# EAGLE design B212C (EAGLE 6.6.0)
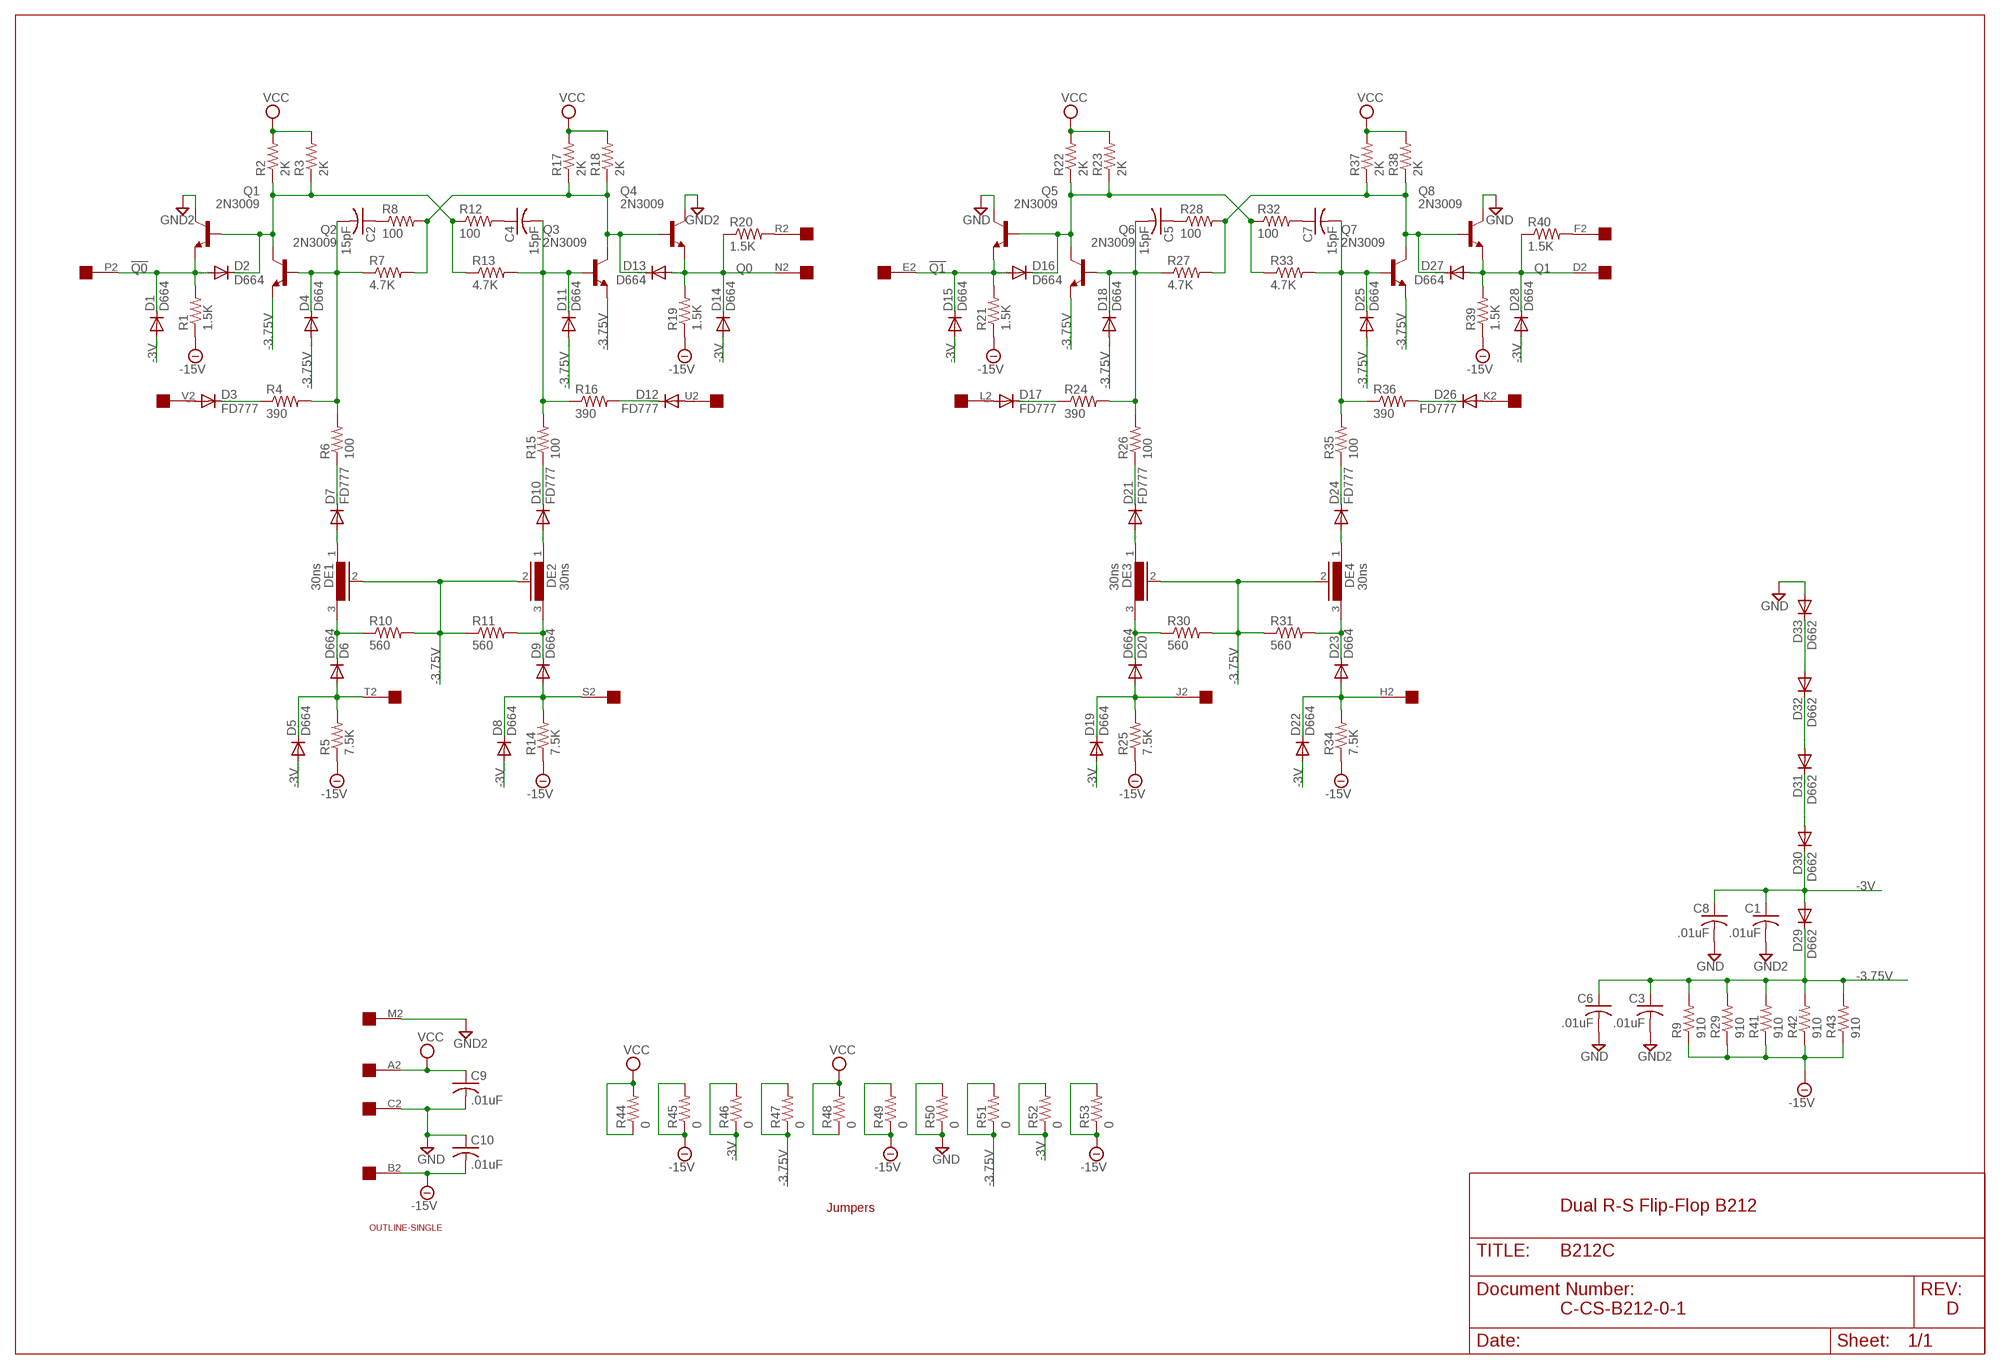
[diagram p0: schematic, sheet 1]

## Parts
C1  .01uF  C-US  [C063-025X075]
C2  15pF  C-US  [C063-025X075]
C3  .01uF  C-US  [C063-025X075]
C4  15pF  C-US050-025X075  [C050-025X075]
C5  15pF  C-US  [C063-025X075]
C6  .01uF  C-US  [C063-025X075]
C7  15pF  C-US  [C063-025X075]
C8  .01uF  C-US  [C063-025X075]
C9  .01uF  C-US  [C063-025X075]
C10  .01uF  C-US  [C063-025X075]
D1  D664  DIODE-DO35-10  [DO35-10]
D2  D664  DIODE-DO35-10  [DO35-10]
D3  FD777  DIODE-DO35-10  [DO35-10]
D4  D664  DIODE-DO35-10  [DO35-10]
D5  D664  DIODE-DO35-10  [DO35-10]
D6  D664  DIODE-DO35-10  [DO35-10]
D7  FD777  DIODE-DO35-10  [DO35-10]
D8  D664  DIODE-DO35-10  [DO35-10]
D9  D664  DIODE-DO35-10  [DO35-10]
D10  FD777  DIODE-DO35-10  [DO35-10]
D11  D664  DIODE-DO35-10  [DO35-10]
D12  FD777  DIODE-DO35-10  [DO35-10]
D13  D664  DIODE-DO35-10  [DO35-10]
D14  D664  DIODE-DO35-10  [DO35-10]
D15  D664  DIODE-DO35-10  [DO35-10]
D16  D664  DIODE-DO35-10  [DO35-10]
D17  FD777  DIODE-DO35-10  [DO35-10]
D18  D664  DIODE-DO35-10  [DO35-10]
D19  D664  DIODE-DO35-10  [DO35-10]
D20  D664  DIODE-DO35-10  [DO35-10]
D21  FD777  DIODE-DO35-10  [DO35-10]
D22  D664  DIODE-DO35-10  [DO35-10]
D23  D664  DIODE-DO35-10  [DO35-10]
D24  FD777  DIODE-DO35-10  [DO35-10]
D25  D664  DIODE-DO35-10  [DO35-10]
D26  FD777  DIODE-DO35-10  [DO35-10]
D27  D664  DIODE-DO35-10  [DO35-10]
D28  D664  DIODE-DO35-10  [DO35-10]
D29  D662  DIODE-DO35-10  [DO35-10]
D30  D662  DIODE-DO35-10  [DO35-10]
D31  D662  DIODE-DO35-10  [DO35-10]
D32  D662  DIODE-DO35-10  [DO35-10]
D33  D662  DIODE-DO35-10  [DO35-10]
DE1  30ns  RCL-L-00-05  [RCL-L-00-05]
DE2  30ns  RCL-L-00-05  [RCL-L-00-05]
DE3  30ns  RCL-L-00-05  [RCL-L-00-05]
DE4  30ns  RCL-L-00-05  [RCL-L-00-05]
Q1  2N3009  -NPN-TO5  [TO5]
Q2  2N3009  -NPN-TO5  [TO5]
Q3  2N3009  -NPN-TO5  [TO5]
Q4  2N3009  -NPN-TO5  [TO5]
Q5  2N3009  -NPN-TO5  [TO5]
Q6  2N3009  -NPN-TO5  [TO5]
Q7  2N3009  -NPN-TO5  [TO5]
Q8  2N3009  -NPN-TO5  [TO5]
R1  1.5K  R-US_0207/10  [0207/10]
R2  2K  R-US_0207/10  [0207/10]
R3  2K  R-US_0207/10  [0207/10]
R4  390  R-US_0207/10  [0207/10]
R5  7.5K  R-US_0207/10  [0207/10]
R6  100  R-US_0207/10  [0207/10]
R7  4.7K  R-US_0207/10  [0207/10]
R8  100  R-US_0207/10  [0207/10]
R9  910  R-US_0207/10  [0207/10]
R10  560  R-US_0207/10  [0207/10]
R11  560  R-US_0207/10  [0207/10]
R12  100  R-US_0207/10  [0207/10]
R13  4.7K  R-US_0207/10  [0207/10]
R14  7.5K  R-US_0207/10  [0207/10]
R15  100  R-US_0207/10  [0207/10]
R16  390  R-US_0207/10  [0207/10]
R17  2K  R-US_0207/10  [0207/10]
R18  2K  R-US_0207/10  [0207/10]
R19  1.5K  R-US_0207/10  [0207/10]
R20  1.5K  R-US_0207/10  [0207/10]
R21  1.5K  R-US_0207/10  [0207/10]
R22  2K  R-US_0207/10  [0207/10]
R23  2K  R-US_0207/10  [0207/10]
R24  390  R-US_0207/10  [0207/10]
R25  7.5K  R-US_0207/10  [0207/10]
R26  100  R-US_0207/10  [0207/10]
R27  4.7K  R-US_0207/10  [0207/10]
R28  100  R-US_0207/10  [0207/10]
R29  910  R-US_0207/10  [0207/10]
R30  560  R-US_0207/10  [0207/10]
R31  560  R-US_0207/10  [0207/10]
R32  100  R-US_0207/10  [0207/10]
R33  4.7K  R-US_0207/10  [0207/10]
R34  7.5K  R-US_0207/10  [0207/10]
R35  100  R-US_0207/10  [0207/10]
R36  390  R-US_0207/10  [0207/10]
R37  2K  R-US_0207/10  [0207/10]
R38  2K  R-US_0207/10  [0207/10]
R39  1.5K  R-US_0207/10  [0207/10]
R40  1.5K  R-US_0207/10  [0207/10]
R41  910  R-US_0207/10  [0207/10]
R42  910  R-US_0207/10  [0207/10]
R43  910  R-US_0207/10  [0207/10]
R44  0  R-US_0207/10  [0207/10]
R45  0  R-US_0207/10  [0207/10]
R46  0  R-US_0207/10  [0207/10]
R47  0  R-US_0207/10  [0207/10]
R48  0  R-US_0207/10  [0207/10]
R49  0  R-US_0207/10  [0207/10]
R50  0  R-US_0207/10  [0207/10]
R51  0  R-US_0207/10  [0207/10]
R52  0  R-US_0207/10  [0207/10]
R53  0  R-US_0207/10  [0207/10]
U$1  OUTLINE-SINGLE  [SINGLE]
U$2  EDGE-1  [EDGE-CON1]

## Nets
!Q0: D1.C D2.A Q1.1(E) R1.2 U$2.P2
!Q1: D15.C D16.A Q5.1(E) R21.2 U$2.E2
-3.75V: C3.1 C6.1 D4.A D11.A D18.A D25.A D29.C DE1.2 DE2.2 DE3.2 DE4.2 Q2.1(E) Q3.1(E) Q6.1(E) Q7.1(E) R9.2 R10.2 R11.1 R29.2 R30.2 R31.1 R41.2 R42.2 R43.2 R47.1 R47.2 R51.1 R51.2
-3V: C1.1 C8.1 D1.A D5.A D8.A D14.A D15.A D19.A D22.A D28.A D29.A D30.C R46.1 R46.2 R52.1 R52.2
-15V: C10.2 R1.1 R5.1 R9.1 R14.1 R19.1 R21.1 R25.1 R29.1 R34.1 R39.1 R41.1 R42.1 R43.1 R45.1 R45.2 R49.1 R49.2 R53.1 R53.2 U$2.B2
GND: C6.2 C8.2 C9.2 C10.1 D33.A Q5.3(C) Q8.3(C) R50.1 R50.2 U$2.C2
GND2: C1.2 C3.2 Q1.3(C) Q4.3(C) U$2.M2
N$1: C2.1 R8.1
N$2: C2.2 D4.C Q2.2(B) R4.2 R6.2 R7.1
N$3: D13.C Q3.3(C) Q4.2(B) R7.2 R8.2 R17.1 R18.1
N$4: D2.C Q1.2(B) Q2.3(C) R2.1 R3.1 R12.1 R13.1
N$5: D3.C R4.1
N$6: D30.A D31.C
N$7: D31.A D32.C
N$8: D32.A D33.C
N$9: D3.A U$2.V2
N$10: D7.C R6.1
N$11: D7.A DE1.1
N$12: D9.C DE2.3 R11.2
N$13: D6.C DE1.3 R10.1
N$14: D5.C D6.A R5.2 U$2.T2
N$15: C4.1 R12.2
N$16: C4.2 D11.C Q3.2(B) R13.2 R15.2 R16.1
N$17: D10.A DE2.1
N$18: D10.C R15.1
N$19: D12.A U$2.U2
N$20: D12.C R16.2
N$21: R20.2 U$2.R2
N$22: D8.C D9.A R14.2 U$2.S2
N$23: D16.C Q5.2(B) Q6.3(C) R22.1 R23.1 R32.1 R33.1
N$24: D26.C R36.2
N$25: C5.2 D18.C Q6.2(B) R24.2 R26.2 R27.1
N$26: D17.A U$2.L2
N$27: D17.C R24.1
N$28: D21.A DE3.1
N$29: D21.C R26.1
N$30: D19.C D20.A R25.2 U$2.J2
N$31: C5.1 R28.1
N$32: D27.C Q7.3(C) Q8.2(B) R27.2 R28.2 R37.1 R38.1
N$33: C7.1 R32.2
N$34: C7.2 D25.C Q7.2(B) R33.2 R35.2 R36.1
N$35: R40.2 U$2.F2
N$36: D26.A U$2.K2
N$37: D24.A DE4.1
N$38: D24.C R35.1
N$39: D20.C DE3.3 R30.1
N$40: D23.C DE4.3 R31.2
N$41: D22.C D23.A R34.2 U$2.H2
Q0: D13.A D14.C Q4.1(E) R19.2 R20.1 U$2.N2
Q1: D27.A D28.C Q8.1(E) R39.2 R40.1 U$2.D2
VCC: C9.1 R2.2 R3.2 R17.2 R18.2 R22.2 R23.2 R37.2 R38.2 R44.1 R44.2 R48.1 R48.2 U$2.A2

## Notes on the sheet
- Jumpers | Dual R-S Flip-Flop B212
- C-CS-B212-0-1 | D

## Library data of the parts
C1-C3 C5-C10 = dec-con:C-US: Capacitors with funky DEC lead spacing.
C4 = rcl:C-US: CAPACITOR, American symbol
D1-D33 = diode:DIODE-: DIODE
DE1-DE4 = dec-con:RCL-L-00-05: RCL-L Delay Line
Q1-Q8 = transistor:*-NPN-: NPN Transistror BF959 corrected 2008.03.06
R1-R53 = rcl:R-US_: RESISTOR, American symbol
U$1 = dec-con:OUTLINE-*: Board outlines for DEC boards.
U$2 = dec-con:EDGE-1: Single-Sided DEC Edge Connector -- (side 2)

## Board
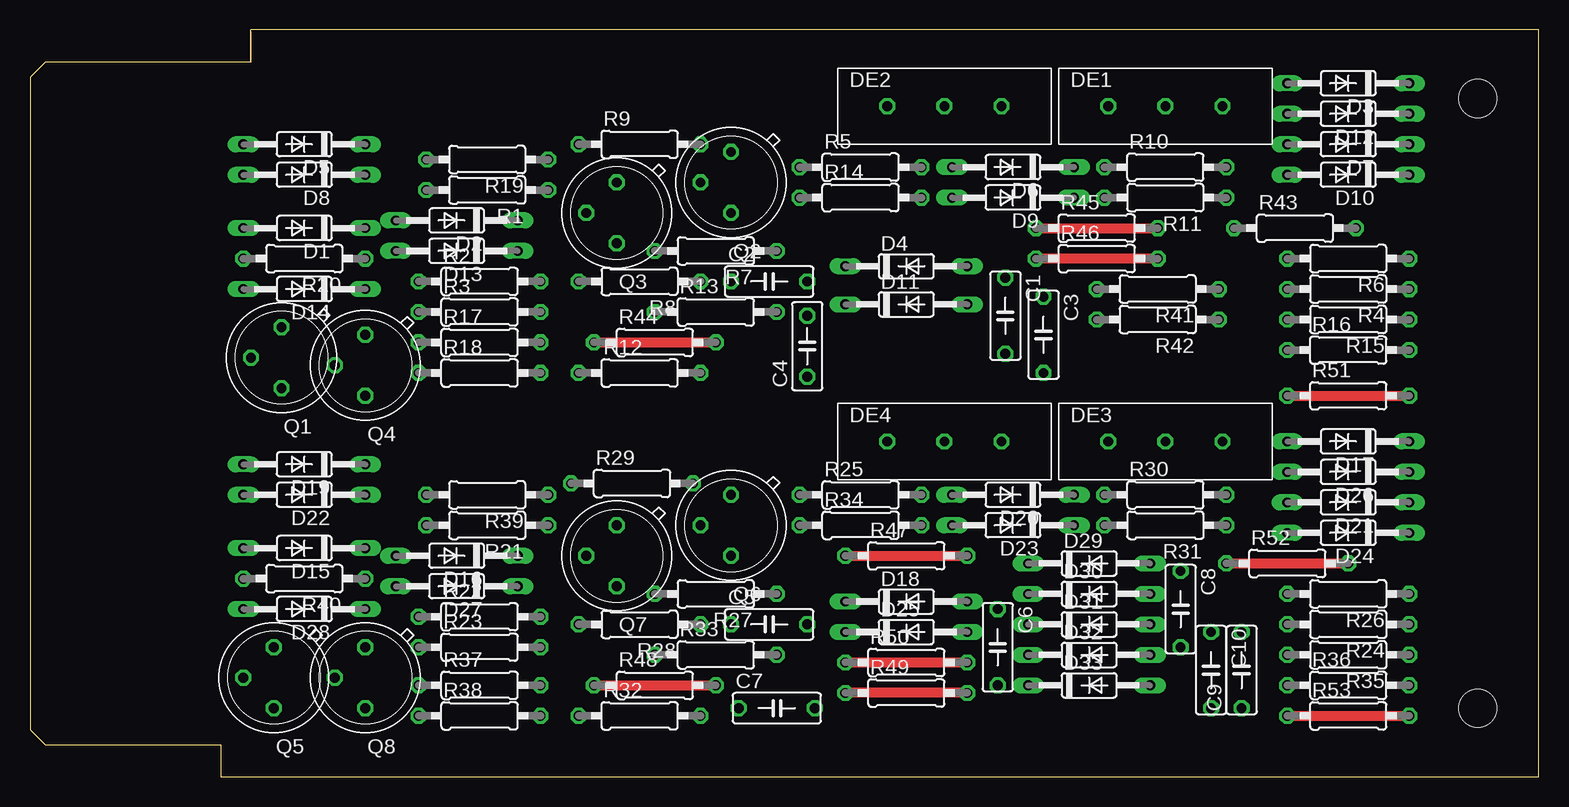
[diagram p1: board, top side]
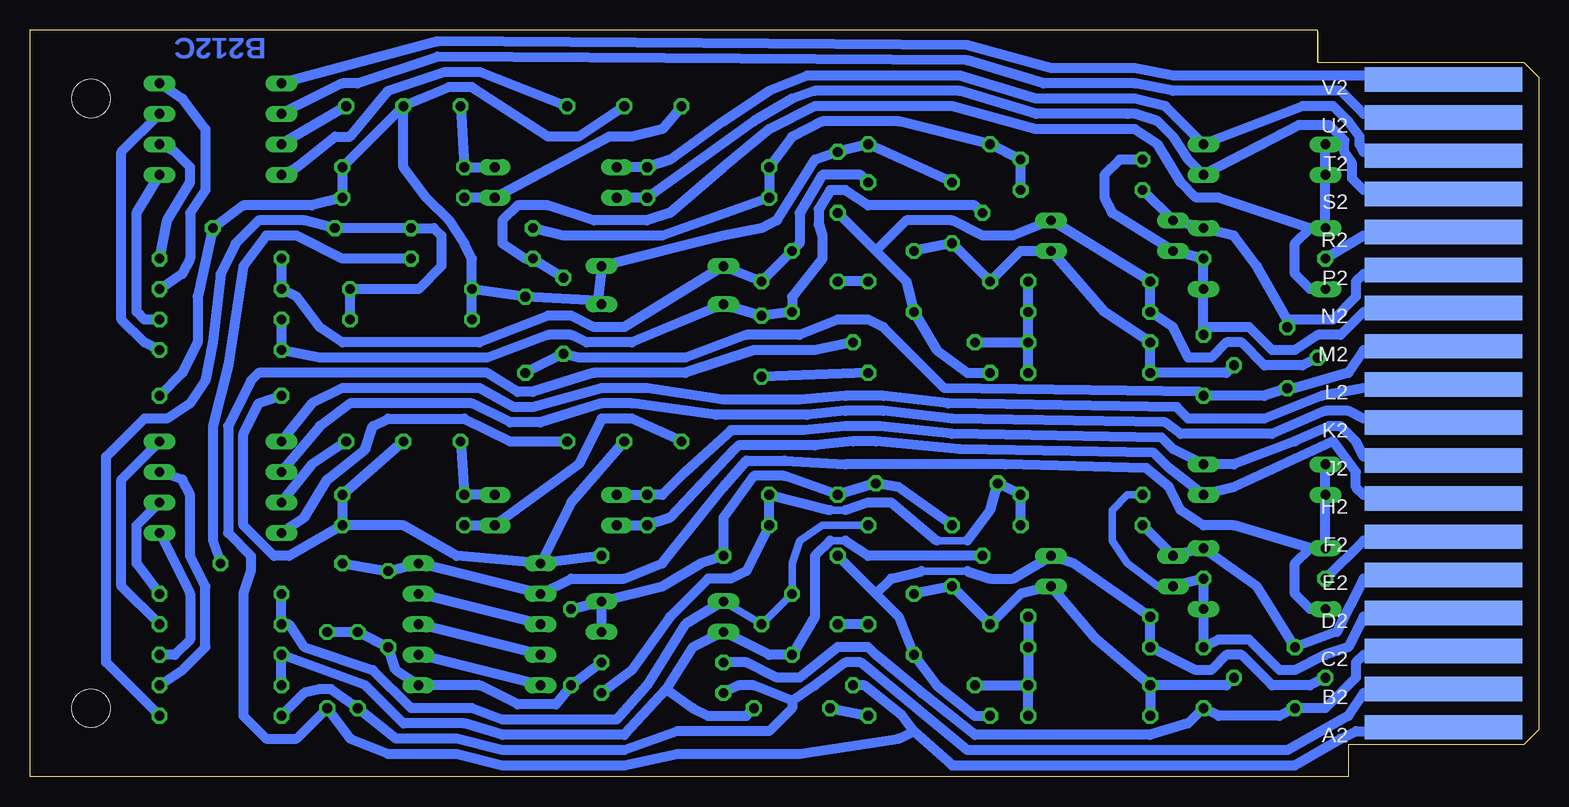
[diagram p2: board, bottom side, seen from below]

Size 125.73 x 62.23 mm. Coordinates in mm from the lower left corner, seen from the top.
Copper layers (1+16): Top 0.035mm / dielectric 1.5mm / Bottom 0.035mm
Design rules "16mils": minimum track width 16mil, minimum drill 32mil, track to track 15mil, track to pad 10mil, pad to pad 10mil, via to via 10mil, smd to smd 10mil, copper to edge 13mil, drill to drill 10mil, minimum pad ring 10mil, minimum via ring 8mil, stop-mask expansion 0mil, vias tented up to drill 0mil, thermal gap 10mil

### Footprints (pad centres in the part's own frame; a part is rotated, then mirrored left to right if it is on the bottom)
C063-025X075 = drill 0.813 octagon: 1 -2.54,0; 2 3.81,0
C050-025X075 = drill 0.813 octagon: 1 -2.54,0; 2 2.54,0
DO35-10 = drill 0.813 long: A 5.08,0; C -5.08,0
RCL-L-00-05 = drill 0.813 octagon: 1 4.763,0; 2 0,0; 3 -4.763,0
TO5 = drill 0.813 octagon: 1 0,-2.54; 2 2.54,0; 3 0,2.54
0207/10 = drill 0.813 octagon: 1 -5.08,0; 2 5.08,0
SINGLE = hole 3.175: 120.65,56.515; 120.65,5.715
EDGE-CON1 = smd 13.106 x 2.032 bottom: A2 7.938,4.128; B2 7.938,7.303; C2 7.938,10.477; D2 7.938,13.652; E2 7.938,16.828; F2 7.938,20.003; H2 7.938,23.177; J2 7.938,26.352; K2 7.938,29.527; L2 7.938,32.703; M2 7.938,35.877; N2 7.938,39.053; P2 7.938,42.227; R2 7.938,45.403; S2 7.938,48.578; T2 7.938,51.752; U2 7.938,54.928; V2 7.938,58.102

### Placement (x,y rotation side)
C1  81.28,39.05 270 top
C2  60.96,41.27 0 top
C3  84.46,37.47 270 top
C4  64.77,35.88 90 top
C5  60.96,12.7 0 top
C6  80.65,11.43 270 top
C7  61.6,5.71 0 top
C8  95.89,14.61 270 top
C9  100.97,8.26 90 top
C10  98.43,9.53 270 top
D1  22.86,45.72 180 top
D2  35.56,46.35 180 top
D3  109.86,57.78 180 top
D4  73.03,42.55 0 top
D5  22.86,52.7 180 top
D6  81.92,50.8 180 top
D7  109.86,52.7 180 top
D8  22.86,50.16 180 top
D9  81.92,48.26 180 top
D10  109.86,50.16 180 top
D11  73.03,39.37 0 top
D12  109.86,55.24 180 top
D13  35.56,43.81 180 top
D14  22.86,40.64 180 top
D15  22.86,19.05 180 top
D16  35.56,18.41 180 top
D17  109.86,27.94 180 top
D18  73.03,14.61 0 top
D19  22.86,26.04 180 top
D20  81.92,23.5 180 top
D21  109.86,22.86 180 top
D22  22.86,23.5 180 top
D23  81.92,20.95 180 top
D24  109.86,20.32 180 top
D25  73.03,12.06 0 top
D26  109.86,25.4 180 top
D27  35.56,15.88 180 top
D28  22.86,13.97 180 top
D29  88.27,17.78 0 top
D30  88.27,15.24 0 top
D31  88.27,12.7 0 top
D32  88.27,10.16 0 top
D33  88.27,7.62 0 top
DE1  94.62,55.88 0 top
DE2  76.2,55.88 0 top
DE3  94.62,27.94 0 top
DE4  76.2,27.94 0 top
Q1  20.96,34.92 180 top
Q2  58.42,49.53 180 top
Q3  48.9,46.99 180 top
Q4  27.94,34.29 180 top
Q5  20.32,8.26 180 top
Q6  58.42,20.95 180 top
Q7  48.9,18.41 180 top
Q8  27.94,8.26 180 top
R1  38.1,48.9 180 top
R2  37.47,41.27 0 top
R3  37.47,38.73 0 top
R4  109.86,40.64 180 top
R5  69.22,50.8 0 top
R6  109.86,43.18 180 top
R7  57.15,43.81 180 top
R8  50.8,41.27 180 top
R9  50.8,52.7 0 top
R10  94.62,50.8 0 top
R11  94.62,48.26 180 top
R12  50.8,33.66 0 top
R13  57.15,38.73 0 top
R14  69.22,48.26 0 top
R15  109.86,38.1 180 top
R16  109.86,35.56 0 top
R17  37.47,36.2 0 top
R18  37.47,33.66 0 top
R19  38.1,51.44 180 top
R20  22.86,43.18 180 top
R21  38.1,20.95 180 top
R22  37.47,13.34 0 top
R23  37.47,10.79 0 top
R24  109.86,12.7 180 top
R25  69.22,23.5 0 top
R26  109.86,15.24 180 top
R27  57.15,15.24 180 top
R28  50.8,12.7 180 top
R29  50.17,24.45 0 top
R30  94.62,23.5 0 top
R31  94.62,20.95 180 top
R32  50.8,5.08 0 top
R33  57.15,10.16 0 top
R34  69.22,20.95 0 top
R35  109.86,10.16 180 top
R36  109.86,7.62 0 top
R37  37.47,7.62 0 top
R38  37.47,5.08 0 top
R39  38.1,23.5 180 top
R40  22.86,16.51 180 top
R41  93.98,40.64 180 top
R42  93.98,38.1 180 top
R43  105.41,45.72 0 top
R44  52.07,36.2 0 top
R45  88.9,45.72 0 top
R46  88.9,43.18 0 top
R47  73.03,18.41 0 top
R48  52.07,7.62 0 top
R49  73.03,6.99 0 top
R50  73.03,9.53 0 top
R51  109.86,31.75 0 top
R52  104.78,17.78 0 top
R53  109.86,5.08 0 top
U$1  0,0 0 top
U$2  0,0 0 top

### Tracks (layer width: path | path; a pad name or v marks a point on that pad's centre or on a via)
!Q0
  Bottom 0.813: U$2.P2 8.26,41.91 14.61,41.91 15.24,41.27 15.24,40.01 17.15,38.1 20.96,38.1 | Q1.1 20.96,38.1 | 20.96,38.1 23.5,42.55 25.4,45.09 D1.C D2.A R1.2
!Q1
  Bottom 0.813: U$2.E2 8.26,16.51 14.61,16.51 16.83,12.06 Q5.1 23.5,15.88 D15.C D16.A R21.2
-3.75V
  Top 0.813: R47.1 R47.2 | R51.1 R51.2
  Bottom 0.813: DE2.2 80.01,53.34 82.55,53.34 88.9,57.47 90.81,57.47 DE1.2 | DE1.2 R10.2 R11.1 102.24,47.62 107.95,47.62 R43.2 111.76,40.01 111.76,36.2 113.03,33.66 R51.2 | 78.42,39.69 D4.A 67.95,45.09 64.77,45.72 63.5,46.35 60.33,51.44 Q2.1 R9.2 Q3.1 | D11.A 78.42,39.69 | 78.42,39.69 C3.1 R41.2 | R41.2 88.9,43.18 89.54,44.45 90.81,46.35 92.71,48.26 94.62,50.8 DE1.2 | R42.2 R41.2 | R47.2 D29.C | DE3.2 R30.2 R31.1 | DE4.2 80.65,22.86 D29.C | D29.C 90.17,18.41 94.62,20.95 R31.1 | Q7.1 53.34,24.13 R29.2 Q6.1 62.87,25.08 65.41,25.08 67.95,21.59 R47.1 69.85,17.78 73.03,15.88 D18.A | C6.1 D18.A | D25.A D18.A | R31.1 104.14,18.41 105.41,18.41 107.95,20.95 107.95,28.57 106.68,31.11 R51.1
-3V
  Top 0.813: R46.2 R46.1 | R52.1 R52.2
  Bottom 0.813: D5.A D8.A D1.A 19.05,45.72 | D14.A 19.05,40.64 20.32,41.91 20.32,44.45 19.05,45.72 | 19.05,45.72 26.67,48.26 28.58,48.26 29.85,49.53 31.75,52.7 33.66,53.98 41.91,53.98 48.9,55.88 60.33,55.88 64.14,53.98 67.95,50.8 72.39,46.99 74.3,46.35 78.74,46.35 82.55,47.62 85.09,47.62 86.36,46.35 86.36,44.45 84.46,43.18 R46.1 C1.1 | R46.2 99.7,43.18 103.51,45.09 106.05,45.09 107.95,42.55 109.22,34.29 110.49,29.21 110.49,19.68 R52.2 | D28.A 19.05,13.97 20.32,15.24 20.32,17.78 19.05,19.05 | 19.05,19.05 D15.A D22.A D19.A | 19.05,19.05 25.4,20.95 27.94,20.95 29.85,22.23 30.8,24.13 32.7,25.72 44.45,26.04 57.79,26.04 62.87,26.35 66.04,26.35 67.95,24.13 73.03,17.78 76.2,16.51 80.65,16.51 D30.C D29.A C8.1 R52.1
-15V
  Top 0.813: R45.1 R45.2 | R49.2 R49.1 | R53.1 R53.2
  Bottom 0.61: 59.06,22.23 57.79,22.23 | 50.17,19.68 47.63,19.68
  Bottom 0.813: R1.1 R19.1 R9.1 53.34,54.61 59.69,54.61 62.23,53.34 R5.1 R14.1 73.03,45.09 81.28,45.09 R45.1 | R42.1 R41.1 93.35,40.64 91.44,42.55 91.44,45.09 92.08,45.72 R45.2 R43.1 102.87,46.35 106.68,46.35 108.59,44.45 109.86,41.91 110.49,36.2 111.13,33.02 112.4,31.11 114.3,29.84 116.21,29.84 119.38,26.67 119.38,9.53 R53.2 | U$2.B2 8.26,6.99 14.61,6.99 15.88,5.08 20.96,2.22 47.63,2.22 56.52,9.53 57.79,9.53 60.33,7.62 62.23,6.35 | R21.1 R39.1 R29.1 45.72,22.23 47.63,19.68 | 59.06,22.23 R25.1 R34.1 66.04,17.14 67.31,16.51 69.22,16.51 72.39,13.34 75.57,8.89 R49.2 | 57.79,22.23 55.88,22.86 53.98,22.86 50.17,19.68 | 62.23,6.35 65.41,7.62 66.68,7.62 R49.1 | 62.23,6.35 62.23,5.71 64.14,3.81 71.76,3.81 76.2,2.22 86.36,2.22 90.17,3.17 95.25,3.17 C10.2 100.65,7.3 101.6,7.3 102.87,6.99 R53.1
GND
  Top 0.813: R50.1 R50.2
  Bottom 0.813: U$2.C2 8.89,10.48 8.89,10.16 14.61,10.16 15.24,9.53 15.24,8.26 17.78,5.71 Q5.3 21.59,5.08 26.67,5.08 Q8.3 29.21,4.45 32.39,3.49 46.99,3.49 51.44,6.99 55.25,10.16 55.88,10.79 58.42,10.79 61.6,8.26 63.5,8.26 66.04,9.53 R50.1 | R50.2 C6.2 81.92,6.03 85.09,6.03 88.27,7.62 D33.A 95.25,8.89 C8.2 C10.1 C9.2
GND2
  Bottom 0.813: C3.2 C1.2 80.01,34.92 71.12,34.92 66.04,36.83 61.6,36.83 58.42,38.1 55.88,38.1 54.61,37.47 49.53,32.38 28.26,32.07 Q4.3 22.86,31.75 Q1.3 20.32,32.38 15.88,33.66 14.61,35.56 9.53,35.56 U$2.M2
N$1
  Bottom 0.813: R8.1 C2.1
N$2
  Bottom 0.813: Q2.2 56.52,50.16 59.69,50.16 61.6,46.99 61.6,44.45 R7.1 C2.2 D4.C 76.2,37.47 78.74,37.47 80.65,38.42 82.55,38.42 88.27,36.2 99.7,36.2 101.6,37.47 103.51,40.01 R4.2 R6.2
N$3
  Bottom 0.813: Q4.2 26.04,33.66 R18.1 R17.1 36.2,38.73 D13.C 43.18,43.81 R8.2 Q3.3 R7.2
N$4
  Bottom 0.813: Q1.2 19.69,34.29 22.86,34.29 24.77,36.2 26.04,36.2 27.31,34.92 29.21,34.92 30.48,37.47 R3.1 R2.1 D2.C 43.82,45.09 46.36,45.09 48.9,46.35 52.71,46.35 55.25,43.81 | 55.25,43.81 Q2.3 | 55.25,43.81 52.71,41.27 R13.1 50.17,35.56 47.63,33.66 R12.1
N$5
  Bottom 0.813: D3.C 113.03,56.52 111.13,53.98 111.13,48.9 112.4,46.99 112.4,43.18 113.03,41.91 R4.1
N$6
  Bottom 0.813: D31.C D30.A
N$7
  Bottom 0.813: D32.C D31.A
N$8
  Bottom 0.813: D33.C D32.A
N$9
  Bottom 0.813: U$2.V2 8.26,58.42 30.48,58.42 33.66,59.05 40.64,59.05 47.63,60.96 91.76,61.28 D3.A
N$10
  Bottom 0.813: R6.1 114.3,46.35 112.4,49.53 112.4,50.8 113.67,52.07 D7.C
N$11
  Bottom 0.813: DE1.1 D7.A
N$12
  Bottom 0.813: DE2.3 73.03,53.98 75.57,53.34 77.47,53.34 D9.C R11.2
N$13
  Bottom 0.813: DE1.3 R10.1 D6.C
N$14
  Bottom 0.813: U$2.T2 8.26,52.07 14.61,52.07 14.92,52.7 14.92,53.34 15.88,54.61 17.15,55.88 19.69,55.88 D5.C 31.12,55.88 33.66,56.52 34.29,56.52 41.91,56.52 48.26,58.42 60.96,58.42 64.14,57.15 67.95,54.61 72.39,51.44 R5.2 D6.A
N$15
  Bottom 0.813: R12.2 C4.1
N$16
  Bottom 0.813: Q3.2 46.99,47.62 55.88,47.62 57.79,48.9 59.06,48.9 60.01,47.31 60.01,46.04 59.69,45.09 59.69,43.18 62.23,40.01 R13.2 C4.2 D11.C 75.57,36.2 79.38,36.2 80.65,36.83 82.55,36.83 87.63,34.92 101.6,34.92 R16.1 R15.2
N$17
  Bottom 0.813: D10.A 103.51,50.8 100.33,53.34 99.06,53.34 95.89,57.15 91.12,58.74 88.27,58.74 DE2.1
N$18
  Bottom 0.813: R15.1 116.21,38.1 116.84,38.73 116.84,46.99 D10.C
N$19
  Bottom 0.813: U$2.U2 8.89,55.24 14.61,55.24 16.51,57.15 30.48,57.15 33.66,57.78 41.28,57.78 47.63,59.69 91.76,60.01 98.43,57.78 99.7,57.78 D12.A
N$20
  Bottom 0.813: R16.2 116.21,36.2 118.11,38.1 118.11,52.07 D12.C
N$21
  Bottom 0.813: U$2.R2 8.89,45.09 14.61,45.09 R20.2
N$22
  Bottom 0.813: D9.A R14.2 65.41,54.61 62.23,56.52 60.33,57.15 48.26,57.15 41.91,55.24 34.29,55.24 33.66,55.24 31.75,54.61 30.48,53.34 29.21,51.44 D8.C 20,54.29 17.46,54.29 16.19,53.02 16.19,52.07 15.56,51.12 15.56,49.85 14.61,48.9 8.89,48.9 U$2.S2
N$23
  Bottom 0.61: 51.44,17.14 47.63,17.14
  Bottom 0.813: Q5.2 19.05,7.62 22.23,7.62 24.77,10.16 26.04,10.16 27.31,8.89 28.58,8.89 R23.1 R22.1 38.74,17.78 D16.C 43.82,16.51 45.72,16.51 47.63,17.14 | Q6.3 55.25,15.24 | 55.25,15.24 53.98,16.51 51.44,17.14 | 55.25,15.24 53.34,13.34 R33.1 50.17,7.62 46.99,5.08 R32.1
N$24
  Bottom 0.813: R36.2 113.03,8.89 111.13,10.79 111.13,15.88 112.4,18.41 112.4,23.5 113.03,24.77 D26.C
N$25
  Bottom 0.61: Q6.2 59.69,20.95 61.6,19.68 62.23,17.78 R27.1 C5.2 D18.C
  Bottom 0.813: D18.C 71.12,12.7 74.3,7.62 76.84,4.76 86.36,4.76 88.9,5.71 93.98,5.71 97.16,8.89 102.87,10.79 104.14,12.7 R24.2 R26.2
N$26
  Bottom 0.813: U$2.L2 8.26,32.38 14.61,32.38 18.1,31.75 22.86,29.84 29.21,29.84 30.16,30.8 49.21,31.11 54.61,31.75 57.79,31.75 61.6,31.43 67.95,31.43 74.3,32.38 78.11,32.38 83.82,30.8 85.41,30.8 88.27,32.38 99.7,32.38 102.24,31.11 D17.A
N$27
  Bottom 0.813: R24.1 118.11,15.88 118.11,24.77 D17.C
N$28
  Bottom 0.813: DE3.1 102.24,26.04 D21.A
N$29
  Bottom 0.813: R26.1 116.84,17.78 116.84,20.95 D21.C
N$30
  Bottom 0.813: U$2.J2 8.89,26.67 14.61,26.67 15.24,27.94 16.51,29.21 17.46,29.21 20.32,27.94 25.4,26.04 D19.C 30.48,27.3 31.43,28.26 48.9,28.57 54.93,29.21 57.79,29.21 61.28,28.89 67.31,28.89 71.12,25.4 73.03,23.5 R25.2 D20.A
N$31
  Bottom 0.813: R28.1 C5.1
N$32
  Bottom 0.813: Q8.2 26.04,7.62 R37.1 | R37.1 R38.1 | R37.1 36.83,11.43 D27.C 43.18,15.24 R28.2 Q7.3 R27.2
N$33
  Bottom 0.813: C7.1 R32.2
N$34
  Bottom 0.61: 57.79,19.68 59.06,19.68
  Bottom 0.813: Q7.2 55.88,18.41 57.79,19.68 | 59.06,19.68 60.33,18.41 60.33,13.34 R33.2 64.14,10.16 D25.C 70.49,10.79 72.71,7.3 | 72.71,7.3 70.49,5.71 69.22,5.08 66.04,5.08 C7.2 | 72.71,7.3 76.2,3.49 86.36,3.49 89.54,4.45 94.62,4.45 97.79,7.62 R35.2 R36.1
N$35
  Bottom 0.813: U$2.F2 8.26,19.68 14.61,19.68 R40.2
N$36
  Bottom 0.813: U$2.K2 8.89,29.84 14.61,29.84 15.88,30.48 17.78,30.48 22.23,28.57 29.85,28.57 31.12,29.53 48.9,29.84 54.61,30.48 57.79,30.48 60.96,30.16 68.58,30.16 75.57,31.11 78.11,31.11 83.19,29.53 85.73,29.53 88.9,31.11 99.06,31.11 101.6,29.21 D26.A
N$37
  Bottom 0.813: D24.A 102.87,21.59 100.97,24.77 97.79,27.3 97.16,29.21 95.89,29.84 89.54,29.84 85.73,27.94 DE4.1
N$38
  Bottom 0.813: D24.C 112.4,15.24 112.4,11.43 113.67,10.16 R35.1
N$39
  Bottom 0.813: DE3.3 R30.1 D20.C
N$40
  Bottom 0.813: DE4.3 75.57,29.84 78.11,29.84 80.01,26.04 D23.C R31.2
N$41
  Bottom 0.813: U$2.H2 8.26,23.5 14.61,23.5 15.24,24.13 15.24,25.4 17.15,27.94 25.4,24.13 D22.C 30.8,25.72 32.07,26.99 48.26,27.3 55.25,27.94 57.15,27.94 60.33,27.62 66.68,27.62 66.99,27.3 72.39,21.59 R34.2 D23.A
Q0
  Bottom 0.813: U$2.N2 8.26,38.73 14.61,38.73 16.51,36.83 18.42,36.83 20.32,35.56 22.23,35.56 24.13,37.47 27.94,37.47 | 27.94,37.47 D14.C R20.1 D13.A 35.56,46.99 36.2,48.26 36.2,50.16 34.93,51.44 R19.2 | Q4.1 27.94,37.47
Q1
  Bottom 0.61: D27.A 31.75,15.88 34.29,17.78 35.56,19.68 35.56,22.23 34.29,23.5 R39.2
  Bottom 0.813: U$2.D2 8.26,13.34 14.61,13.34 15.88,10.79 17.78,10.16 20.32,8.89 21.59,8.89 24.13,11.43 26.67,11.43 Q8.1 D28.C R40.1 D27.A
VCC
  Top 0.813: R44.1 R44.2 | R48.1 R48.2
  Bottom 0.813: R2.2 R3.2 R17.2 | R18.2 R17.2 | R44.1 R17.2 | R44.2 60.33,35.56 65.41,35.56 71.12,33.66 78.74,33.66 83.82,32.07 85.09,32.07 87.63,33.66 106.68,33.66 107.32,33.02 109.22,29.21 109.22,20.32 107.32,18.41 107.32,17.14 107.95,15.24 107.95,5.08 106.05,3.17 103.51,3.17 C9.1 99.06,3.17 95.89,1.91 90.17,1.91 86.36,0.95 76.2,0.95 71.76,1.91 61.6,1.91 53.34,3.17 52.07,3.81 | 52.07,3.81 48.9,0.95 20.32,0.95 16.51,3.17 15.24,3.81 8.26,3.81 U$2.A2 | 52.07,3.81 53.02,5.08 56.2,7.62 R48.2 | R22.2 R23.2 R37.2 | R38.2 R37.2 | R48.1 R37.2

### Text on the board
Bottom: B212C